# Altium schematic sheet Fast_Dimer_Power_Board.SchDoc
size A4
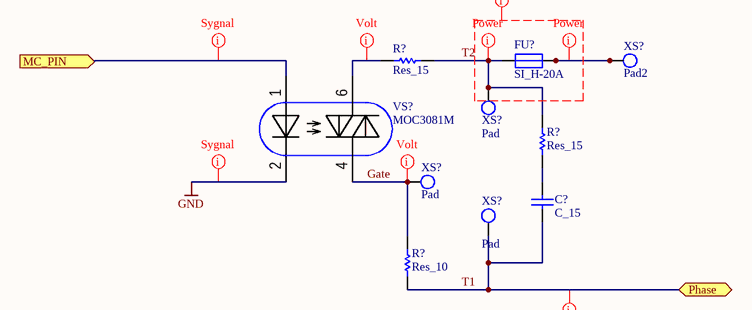
[diagram p0: Fast_Dimer_Power_Board.SchDoc]

## Parts
(Parts that share a designator on the sheet are numbered #1, #2 ... from top to bottom, then left to right.)
C?  C_15  [C-15]
FU?  SI_H-20A  [SI_H-20A]
R?#1  Res_15  [R-15]
R?#2  Res_15  [R-15]
R?#3  Res_10  [R-10]
VS?  MOC3081M  [DIL-06]
XS?#1  Pad2  [LOTPAD_2]
XS?#2  Pad  [LOTPAD]
XS?#3  Pad  [LOTPAD]
XS?#4  Pad  [LOTPAD]

## Ports
MC_PIN (in), Phase (bidir)

## Nets
GND: VS?.2(K)
Gate: R?#3.2 VS?.4(Term2) XS?#3.1
MC_PIN: VS?.1(A) ; port MC_PIN
T1: C?.1 R?#3.1 XS?#4.1 ; port Phase
T2: FU?.4 R?#1.2 R?#2.2 XS?#2.1
NetC?_2: C?.2 R?#2.1
NetFU?_2: FU?.2 FU?.3 XS?#1.1 XS?#1.2
NetR?#1_1: R?#1.1 VS?.6(Term1)

## Layout directives
net class Sygnal; rule Width Constraint [Pref Width = 0.45mm    Min Width = 0.25mm    Max Width = 0.6mm]; rule Clearance Constraint [Clearance = 0.4mm]: GND, MC_PIN
net class Volt; rule Width Constraint [Pref Width = 0.7mm    Min Width = 0.4mm    Max Width = 1mm]; rule Clearance Constraint [Clearance = 3mm]: Gate, NetR?#1_1
net class High Cur Volt; rule Width Constraint [Pref Width = 3.5mm    Min Width = 1.5mm    Max Width = 12mm]; rule Clearance Constraint [Clearance = 3mm]: NetFU?_2, T1, T2
ComponentClass: FU: (no net found under the mark)

## Library data of the parts
FU? = Fuse SI_H-20A: ClassName: FU
VS? = MOC3081M: MOC3081M Optosimistor Driver; ClassName: VS
XS?#1 = Pad2: PCB TH Pad
XS?#2-XS?#4 = Pad: PCB TH Pad
C? = C_15: Value: *
R?#1 R?#2 = Res_15: Value: *
R?#3 = Res_10: Value: *